# Altium project PCB_PROJECT1.PRJPCB
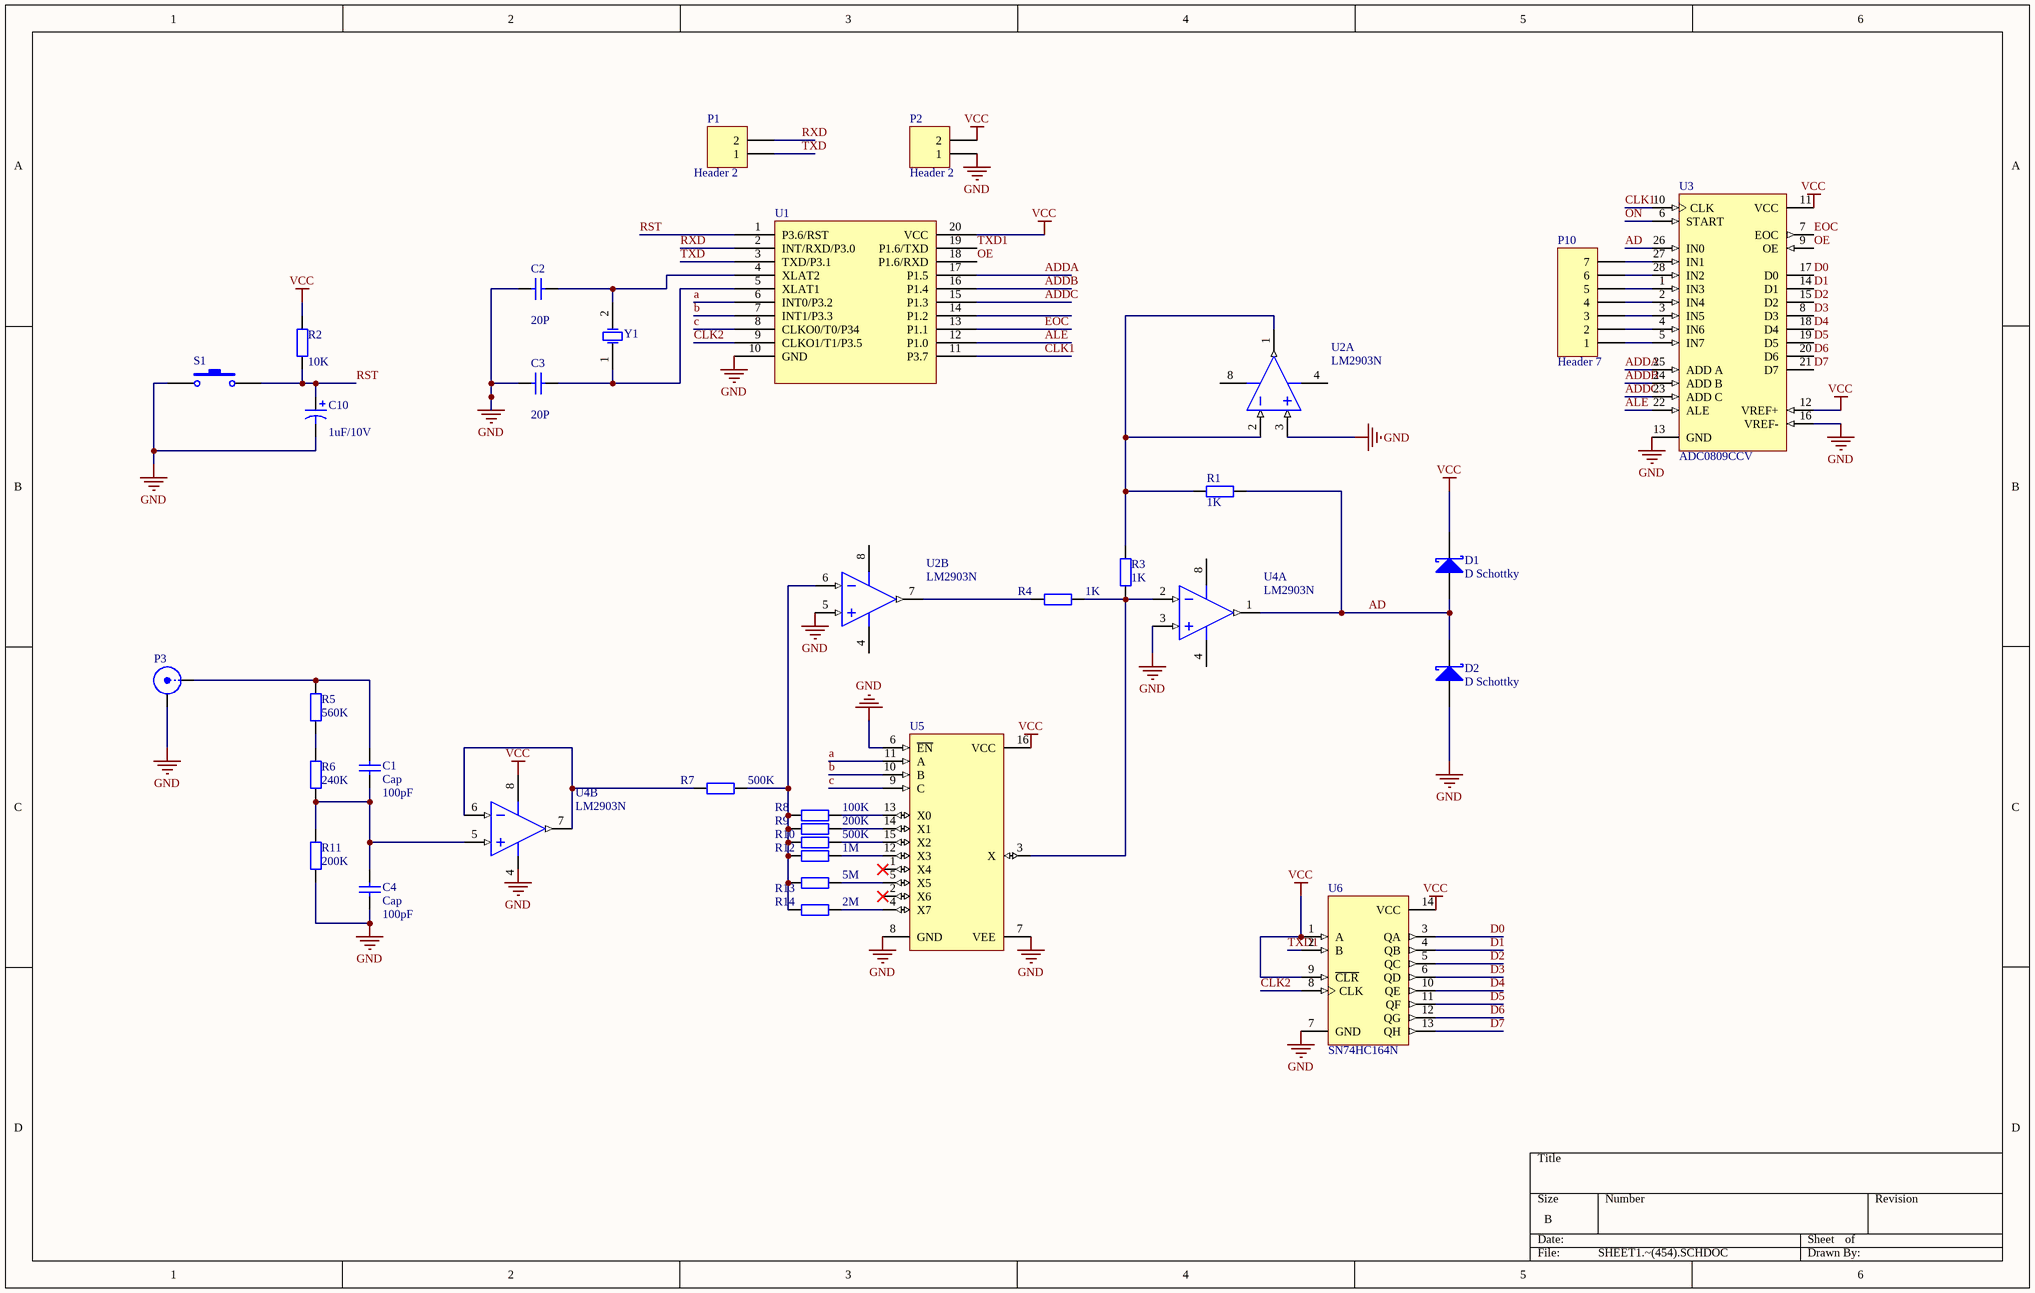
[diagram p0: SHEET1.~(454).SCHDOC]
1 sheet, 33 parts. Net scope: global (net labels, ports and power ports of the same name join across sheets).
Board file: PCB1.~(46).PcbDoc

## Sheet SHEET1.~(454).SCHDOC
size B

### Parts
C1  Cap  value 100pF  [6-0805]
C2  value 20P  [6-0805]  (hidden comment: Cap)
C3  value 20P  [6-0805]  (hidden comment: Cap)
C4  Cap  value 100pF  [6-0805]
C10  value 1uF/10V  [0805C]  (hidden comment: Cap Pol2)
D1  D Schottky  [SMB]
D2  D Schottky  [SMB]
P1  Header 2  [HDR1X2]
P2  Header 2  [HDR1X2]
P3  BNC  [BNC_RA CON]  (value not drawn)
P10  Header 7  [HDR1X7]
R1  value 1K  [6-0805]  (hidden comment: Res2)
R2  value 10K  [6-0805]  (hidden comment: Res2)
R3  value 1K  [6-0805]  (hidden comment: Res2)
R4  value 1K  [6-0805]  (hidden comment: Res2)
R5  value 560K  [6-0805]  (hidden comment: Res2)
R6  value 240K  [6-0805]  (hidden comment: Res2)
R7  value 500K  [6-0805]  (hidden comment: Res2)
R8  value 100K  [6-0805]  (hidden comment: Res2)
R9  value 200K  [6-0805]  (hidden comment: Res2)
R10  value 500K  [6-0805]  (hidden comment: Res2)
R11  value 200K  [6-0805]  (hidden comment: Res2)
R12  value 1M  [6-0805]  (hidden comment: Res2)
R13  value 5M  [6-0805]  (hidden comment: Res2)
R14  value 2M  [6-0805]  (hidden comment: Res2)
S1  SW-PB  [按键]  (value not drawn)
U1  STC11F02  [SSOP20]  (value not drawn)
U2  LM2903N  [DIP-8]  (parts A,B of 2)
U3  ADC0809CCV  [DIP28]
U4  LM2903N  [DIP-8]  (parts A,B of 2)
U5  74VHC4051M  [DIP-16]  (value not drawn)
U6  SN74HC164N  [DIP-14]
Y1  12MHZ  [XTAL-200mil]  (value not drawn)

### Nets
GND: C2.1 C3.1 C4.1 C10.2 D2.1(A) P2.1 P3.2(Y) R11.1 S1.1 U1.10(GND) U2.3(IN+) U2.5(IN+) U3.13(GND) U3.16(VREF-) U4.3(IN+) U5.6(~{EN}) U5.7(VEE) U5.8(GND) U6.7(GND)
VCC: D1.2(K) P2.2 R2.2 U1.20(VCC) U3.11(VCC) U3.12(VREF+) U4.8(V+) U5.16(VCC) U6.1(A) U6.9(~{CLR}) U6.14(VCC)
a: U1.6(INT0/P3.2) U5.11(A)
AD: D1.1(A) D2.2(K) R1.1 U3.26(IN0) U4.1(OUT)
ADDA: U1.17(P1.5) U3.25(ADD_A)
ADDB: U1.16(P1.4) U3.24(ADD_B)
ADDC: U1.15(P1.3) U3.23(ADD_C)
ALE: U1.12(P1.0) U3.22(ALE)
b: U1.7(INT1/P3.3) U5.10(B)
c: U1.8(CLKO0/T0/P34) U5.9(C)
CLK1: U1.11(P3.7) U3.10(CLK)
CLK2: U1.9(CLKO1/T1/P3.5) U6.8(CLK)
D0: U3.17(D0) U6.3(QA)
D1: U3.14(D1) U6.4(QB)
D2: U3.15(D2) U6.5(QC)
D3: U3.8(D3) U6.6(QD)
D4: U3.18(D4) U6.10(QE)
D5: U3.19(D5) U6.11(QF)
D6: U3.20(D6) U6.12(QG)
D7: U3.21(D7) U6.13(QH)
EOC: U1.13(P1.1) U3.7(EOC)
OE: U1.18(P1.6/RXD) U3.9(OE)
ON: U3.6(START)
RST: C10.1 R2.1 S1.2 U1.1(P3.6/RST)
RXD: P1.2 U1.2(INT/RXD/P3.0)
TXD: P1.1 U1.3(TXD/P3.1)
TXD1: U1.19(P1.6/TXD) U6.2(B)
NetC1_1: C1.1 C4.2 R6.1 R11.2 U4.5(IN+)
NetC1_2: C1.2 P3.1(X) R5.2
NetC2_2: C2.2 U1.4(XLAT2) Y1.2(OSC2)
NetC3_2: C3.2 U1.5(XLAT1) Y1.1(OSC1)
NetP10_1: P10.1 U3.5(IN7)
NetP10_2: P10.2 U3.4(IN6)
NetP10_3: P10.3 U3.3(IN5)
NetP10_4: P10.4 U3.2(IN4)
NetP10_5: P10.5 U3.1(IN3)
NetP10_6: P10.6 U3.28(IN2)
NetP10_7: P10.7 U3.27(IN1)
NetR1_2: R1.2 R3.2 U2.1(OUT) U2.2(IN-)
NetR3_1: R3.1 R4.2 U4.2(IN-) U5.3(X)
NetR4_1: R4.1 U2.7(OUT)
NetR5_1: R5.1 R6.2
NetR7_1: R7.1 U4.6(IN-) U4.7(OUT)
NetR7_2: R7.2 R8.1 R9.1 R10.1 R12.1 R13.1 R14.1 U2.6(IN-)
NetR8_2: R8.2 U5.13(X0)
NetR9_2: R9.2 U5.14(X1)
NetR10_2: R10.2 U5.15(X2)
NetR12_2: R12.2 U5.12(X3)
NetR13_2: R13.2 U5.5(X5)
NetR14_2: R14.2 U5.4(X7)

Not connected (* = marked no-connect by the designer): U1 14(P1.2); U2 4(GND) 8(V+); U4 4(GND); U5 1(X4)* 2(X6)*

### Notes on the sheet
- Labels drawn without touching a wire or pin: GND

### Library data of the parts
C1-C4 = Cap: Capacitor; Published: 8-Jun-2000; LatestRevisionDate: 17-Jul-2002; LatestRevisionNote: Re-released for DXP Platform.; PackageReference: RAD-0.3; Publisher: Altium Limited
C10 = Cap Pol2: Polarized Capacitor (Axial); Published: 8-Jun-2000; LatestRevisionDate: 17-Jul-2002; LatestRevisionNote: Re-released for DXP Platform.; PackageReference: POLAR0.8; Publisher: Altium Limited
D1 D2 = D Schottky: Schottky Diode; Published: 8-Jun-2000; LatestRevisionDate: 17-Jul-2002; LatestRevisionNote: Re-released for DXP Platform.; PackageReference: SMB; Publisher: Altium Limited; Code_JEDEC: DO-214-AA
P1 P2 = Header 2: Header, 2-Pin; LatestRevisionDate: 17-Jul-2002; LatestRevisionNote: Re-released for DXP Platform.; Publisher: Altium Limited
P3 = BNC: BNC Elbow Connector; LatestRevisionDate: 17-Jul-2002; LatestRevisionNote: Re-released for DXP Platform.; Publisher: Altium Limited
P10 = Header 7: Header, 7-Pin; LatestRevisionDate: 17-Jul-2002; LatestRevisionNote: Re-released for DXP Platform.; Publisher: Altium Limited
R1-R14 = Res2: Resistor; Published: 8-Jun-2000; LatestRevisionDate: 17-Jul-2002; LatestRevisionNote: Re-released for DXP Platform.; PackageReference: AXIAL-0.4; Publisher: Altium Limited
S1 = SW-PB: Switch; Published: 24-Mar-1999; LatestRevisionDate: 17-Jul-2002; LatestRevisionNote: Re-released for DXP Platform.; PackageReference: SPST-2; Publisher: Altium Limited
U2 U4 = LM2903N: Low-Power Low Offset Voltage Dual Comparator; Published: 15-Apr-2002; LatestRevisionDate: 06-Jun-2005; LatestRevisionNote: Stylized 3D Model Added.; DatasheetVersion: Oct-1999; PackageVersion: Sep-1997; PackageReference: N08E; Publisher: Altium Limited; PackageDescription: DIP; 8 Leads; Row Spacing 7.62 mm; Pitch 2.54 mm; ComponentLink1Description: Manufacturer Link; ComponentLink1URL: http://www.national.com/; ComponentLink2Description: Datasheet; ComponentLink2URL: http://www.national.com/ds.cgi/LM/LM193.pdf; ComponentLink3Description: URL Link1; ComponentLink3URL: http://www.national.com/pf/LM/LM2903.html
U3 = ADC0809CCV: 8-Bit µP-Compatible A/D Converter with 8-Channel Multiplexer; Published: 15-Apr-2002; LatestRevisionDate: 13-Apr-2006; LatestRevisionNote: IPC-7351 Footprint Added.; DatasheetVersion: Oct-1999; PackageVersion: 2000; PackageReference: V28A; Publisher: Altium Limited; PackageDescription: 28-Pin Leaded Chip Carrier 1.27 mm Pitch; Code_IPC: PLCC-28; ComponentLink1Description: Manufacturer Link; ComponentLink1URL: http://www.national.com/; ComponentLink2Description: Datasheet; ComponentLink2URL: http://www.national.com/ds.cgi/DC/ADC0808.pdf; ComponentLink3Description: URL Link1; ComponentLink3URL: http://www.national.com/pf/DC/ADC0809.html
U5 = 74VHC4051M: 8-Channel Analog Multiplexer; Published: 17-Jul-2002; LatestRevisionDate: 13-Apr-2006; LatestRevisionNote: IPC-7351 Footprint Added.; DatasheetVersion: Apr-1999; PackageVersion: 2000; PackageReference: M16A; Publisher: Altium Limited; PackageDescription: 16-Pin Small Outline Integrated Circuit 1.27 mm Pitch; Code_IPC: SOIC127P600-16; ComponentLink1Description: Manufacturer Link; ComponentLink1URL: http://www.fairchildsemi.com/; ComponentLink2Description: Datasheet; ComponentLink2URL: http://www.fairchildsemi.com/ds/74%2F74VHC4051.pdf
U6 = SN74HC164N: 8-Bit Parallel-Out Serial Shift Register; Published: 8-Jun-2000; LatestRevisionDate: 04-Mar-2005; LatestRevisionNote: Stylized 3D Model Added.; DatasheetVersion: May-1997; PackageVersion: Oct-1995; PackageReference: N014; Publisher: Altium Limited; PackageDescription: DIP; 14 Leads; Row Spacing 7.62 mm; Pitch 2.54 mm; ComponentLink1Description: Manufacturer Link; ComponentLink1URL: http://www.ti.com/; ComponentLink2Description: Datasheet; ComponentLink2URL: http://www-s.ti.com/sc/ds/sn74hc164.pdf
Y1 = XTAL: Crystal Oscillator; Published: 8-Jun-2000; LatestRevisionDate: 17-Jul-2002; LatestRevisionNote: Re-released for DXP Platform.; PackageReference: R38; Publisher: Altium Limited